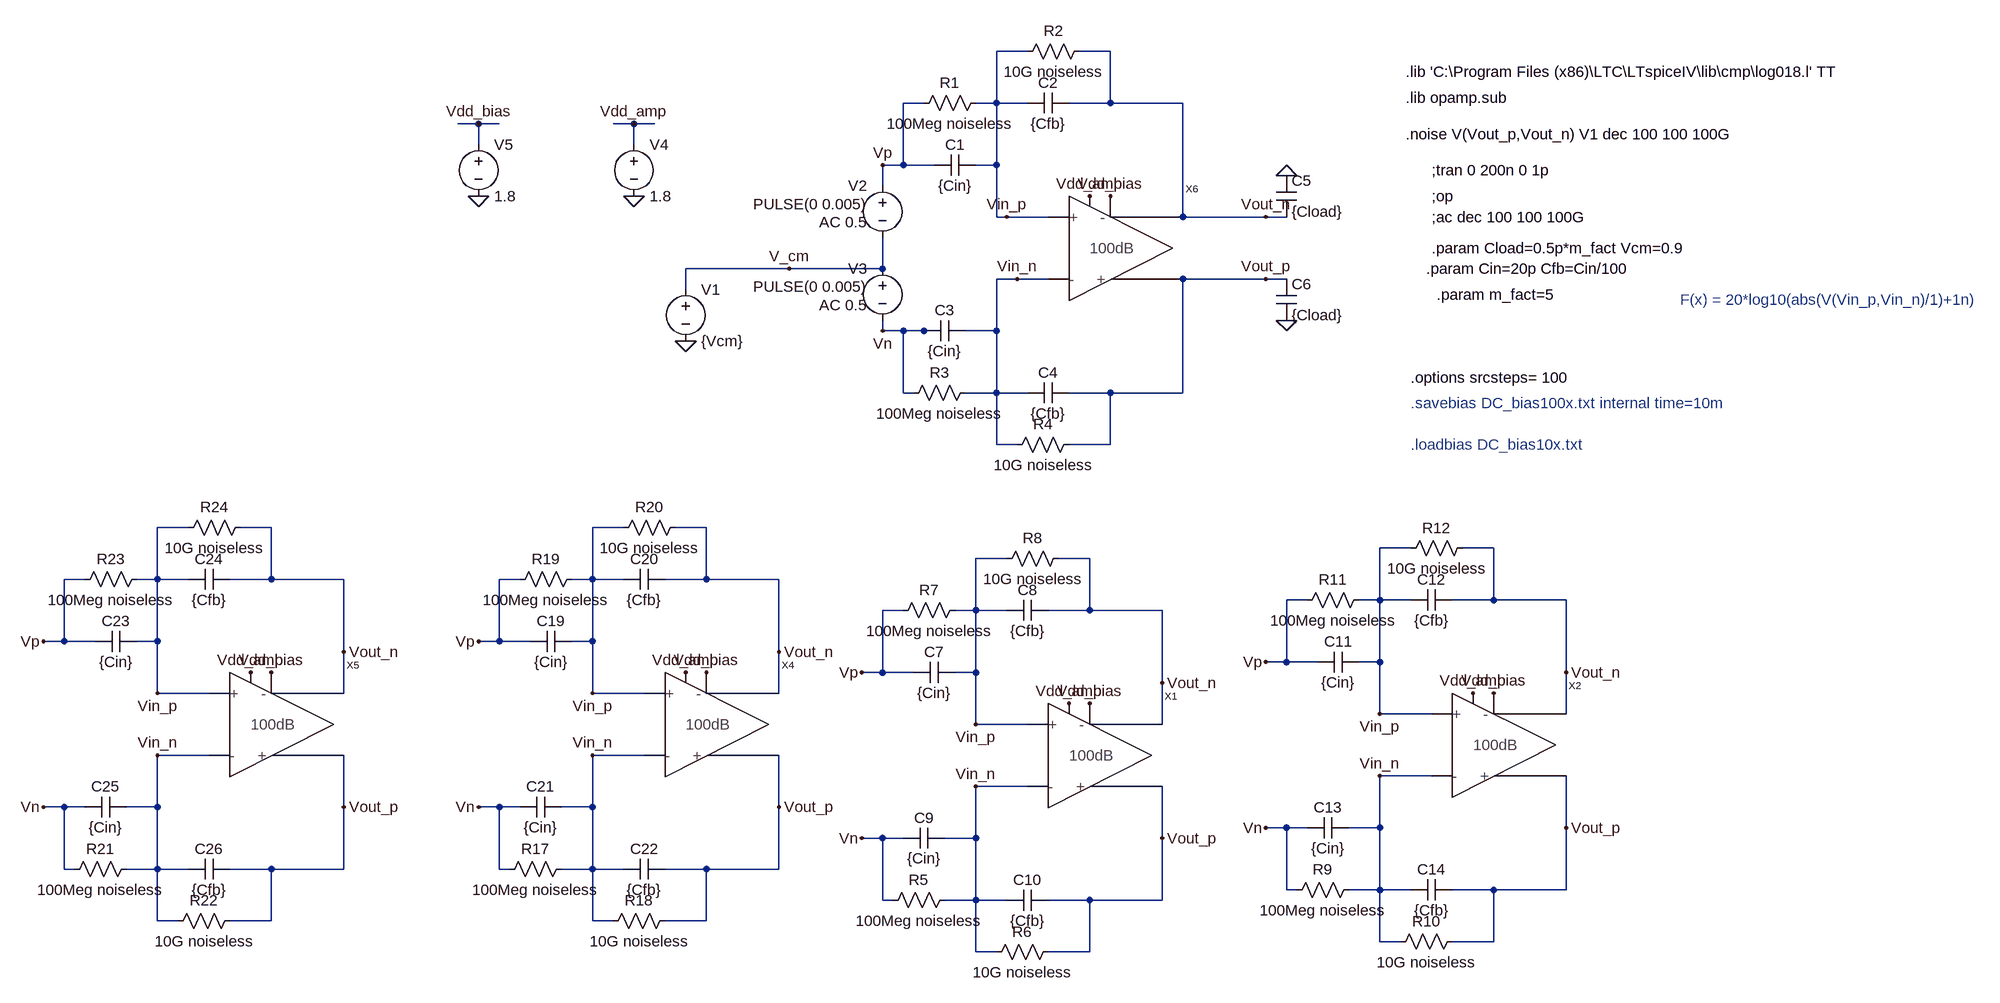
[diagram p0: schematic Discrete_amplifier_10x.asc]
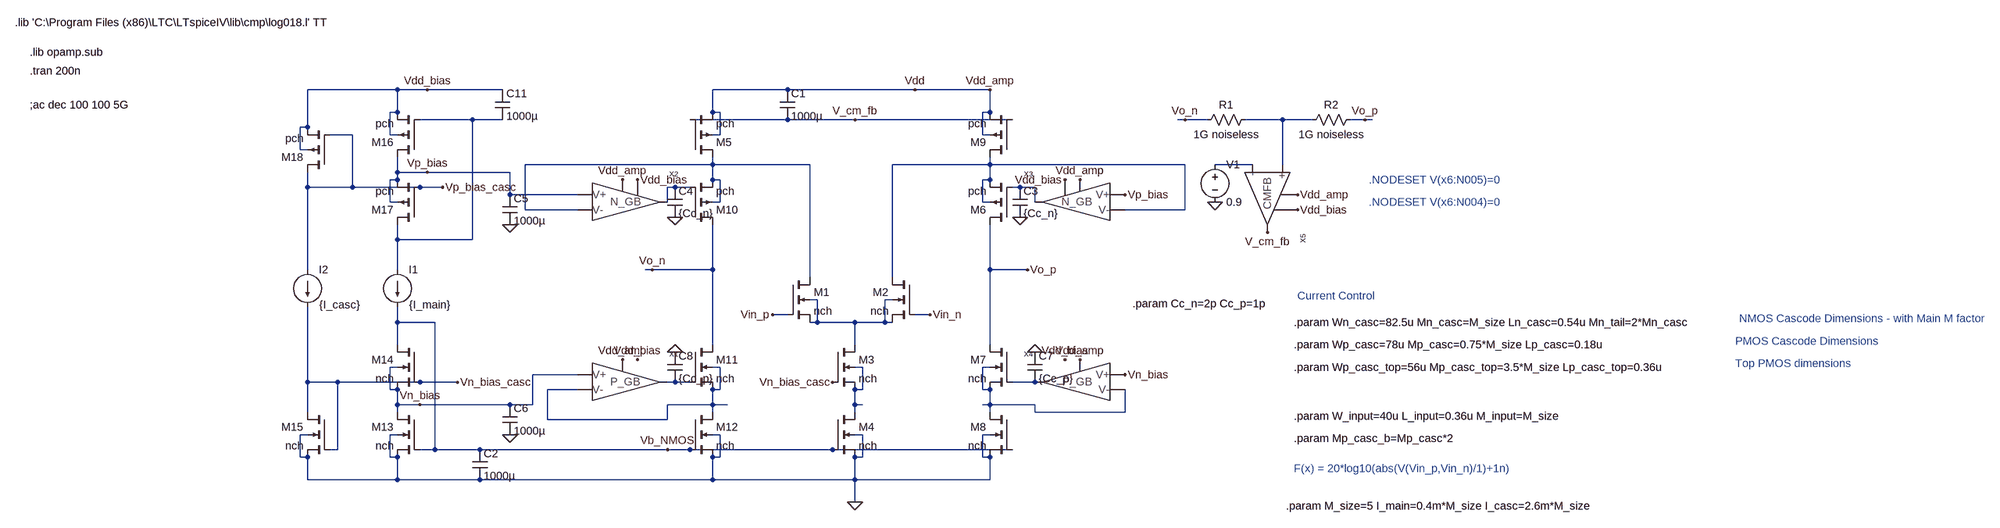
[diagram p1: sub-circuit amplifier_10x_comp_model.asc]
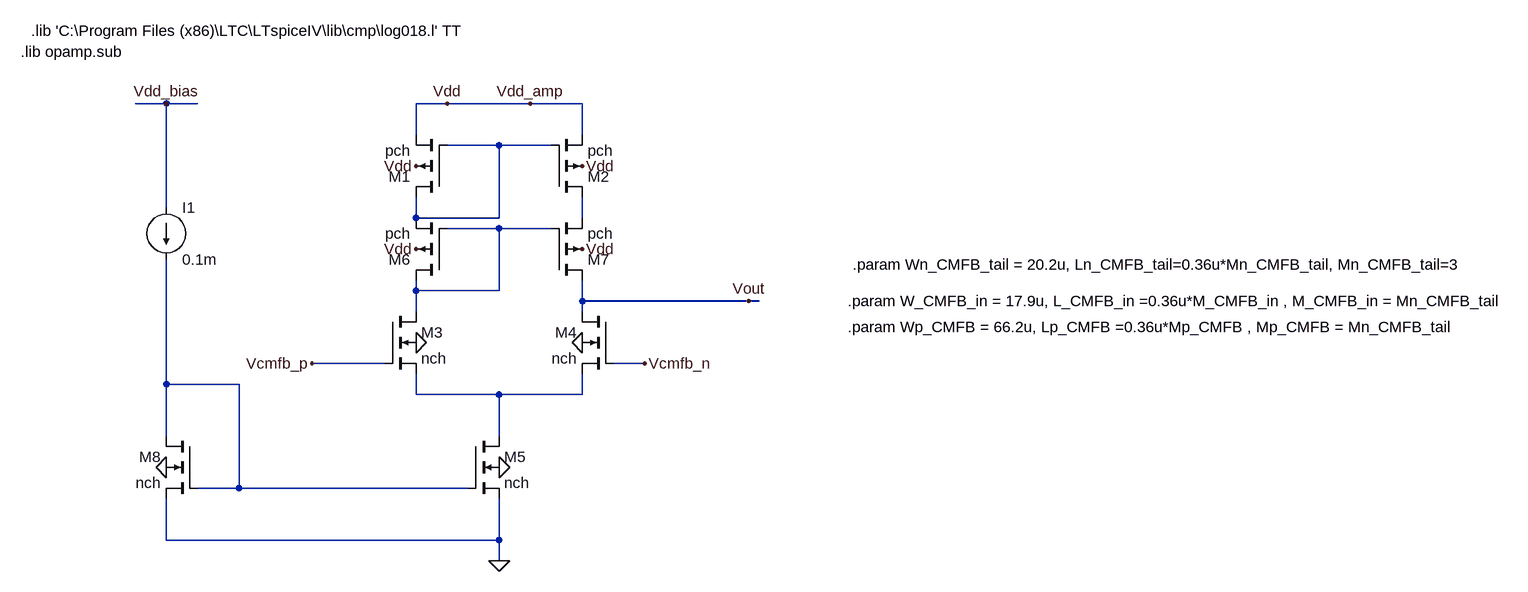
[diagram p2: sub-circuit cmfb_amplifier_comp_model.asc]
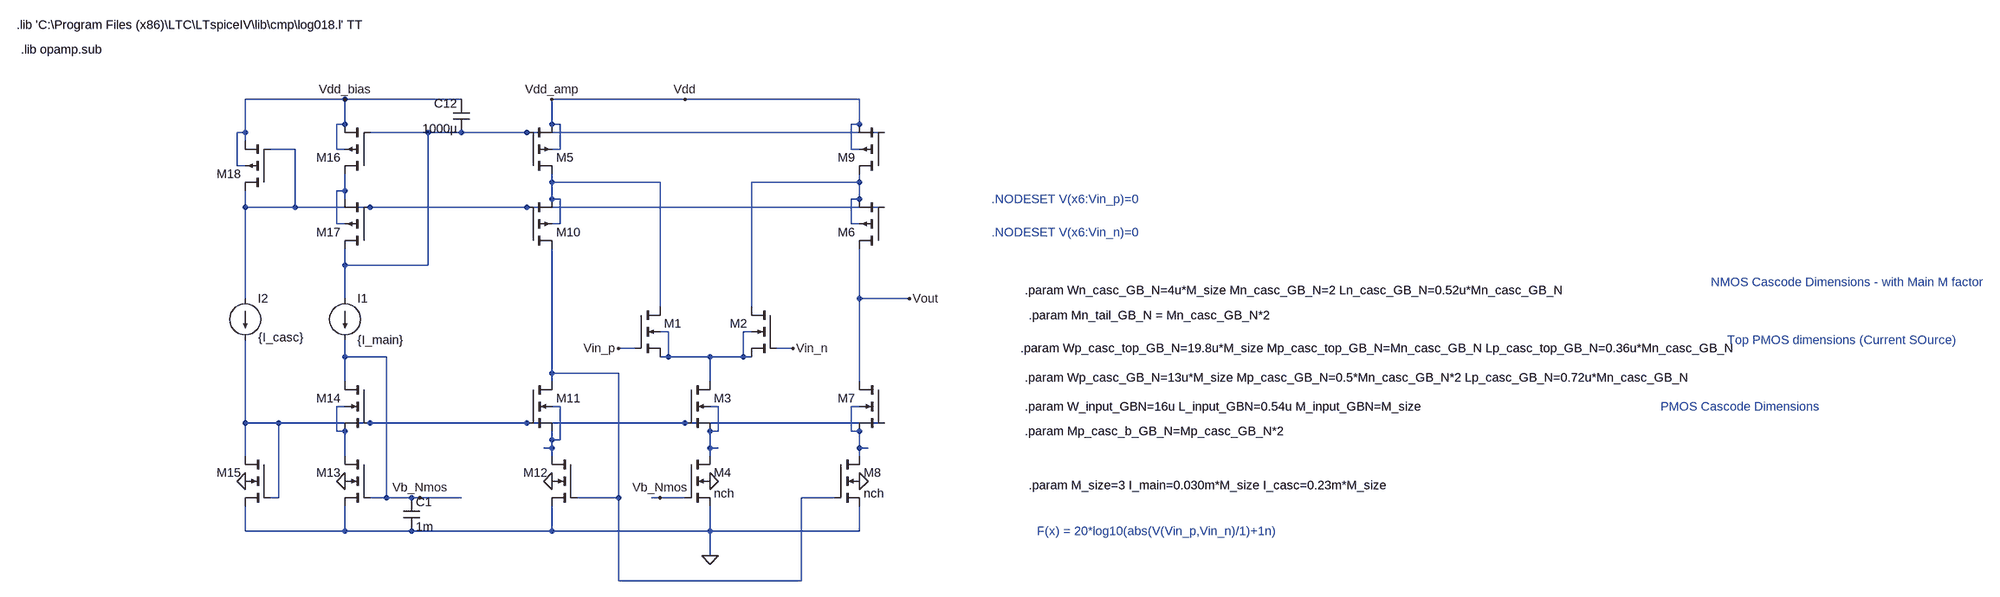
[diagram p3: sub-circuit gb-nmos.asc]
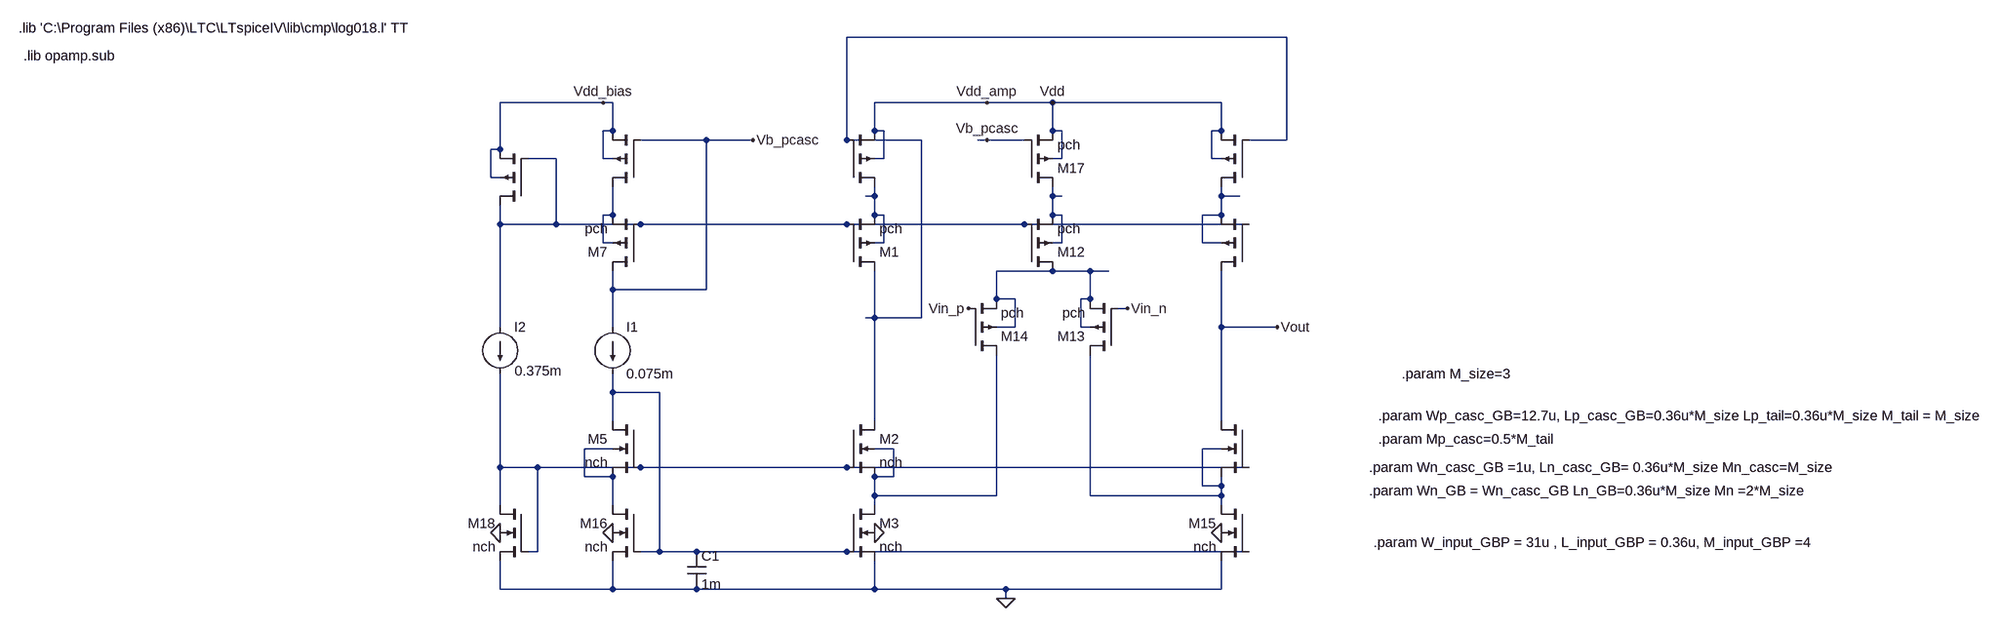
[diagram p4: sub-circuit gb-pmos.asc]
Discrete_amplifier_10x.asc, the LTspice schematic file:
Version 4
SHEET 1 1004 864
WIRE -592 -608 -640 -608
WIRE -464 -608 -512 -608
WIRE -752 -528 -784 -528
WIRE -640 -528 -640 -608
WIRE -640 -528 -672 -528
WIRE -592 -528 -640 -528
WIRE -464 -528 -464 -608
WIRE -464 -528 -528 -528
WIRE -352 -528 -464 -528
WIRE -1440 -496 -1472 -496
WIRE -1408 -496 -1440 -496
WIRE -1200 -496 -1232 -496
WIRE -1168 -496 -1200 -496
WIRE -1440 -464 -1440 -496
WIRE -1200 -464 -1200 -496
WIRE -784 -432 -784 -528
WIRE -784 -432 -816 -432
WIRE -736 -432 -784 -432
WIRE -640 -432 -640 -528
WIRE -640 -432 -672 -432
WIRE -816 -400 -816 -432
WIRE -640 -352 -640 -432
WIRE -624 -352 -640 -352
WIRE -560 -352 -624 -352
WIRE -352 -352 -352 -528
WIRE -224 -352 -352 -352
WIRE -192 -352 -224 -352
WIRE -960 -272 -1120 -272
WIRE -816 -272 -816 -320
WIRE -816 -272 -960 -272
WIRE -608 -256 -640 -256
WIRE -560 -256 -608 -256
WIRE -224 -256 -352 -256
WIRE -192 -256 -224 -256
WIRE -1120 -240 -1120 -272
WIRE -816 -176 -816 -192
WIRE -784 -176 -816 -176
WIRE -752 -176 -784 -176
WIRE -736 -176 -752 -176
WIRE -640 -176 -640 -256
WIRE -640 -176 -688 -176
WIRE -784 -80 -784 -176
WIRE -768 -80 -784 -80
WIRE -640 -80 -640 -176
WIRE -640 -80 -688 -80
WIRE -592 -80 -640 -80
WIRE -464 -80 -528 -80
WIRE -352 -80 -352 -256
WIRE -352 -80 -464 -80
WIRE -640 0 -640 -80
WIRE -608 0 -640 0
WIRE -464 0 -464 -80
WIRE -464 0 -528 0
WIRE -1888 128 -1936 128
WIRE -1760 128 -1808 128
WIRE -1216 128 -1264 128
WIRE -1088 128 -1136 128
WIRE 0 160 -48 160
WIRE 128 160 80 160
WIRE -624 176 -672 176
WIRE -496 176 -544 176
WIRE -2048 208 -2080 208
WIRE -1936 208 -1936 128
WIRE -1936 208 -1968 208
WIRE -1888 208 -1936 208
WIRE -1760 208 -1760 128
WIRE -1760 208 -1824 208
WIRE -1648 208 -1760 208
WIRE -1376 208 -1408 208
WIRE -1264 208 -1264 128
WIRE -1264 208 -1296 208
WIRE -1216 208 -1264 208
WIRE -1088 208 -1088 128
WIRE -1088 208 -1152 208
WIRE -976 208 -1088 208
WIRE -160 240 -192 240
WIRE -48 240 -48 160
WIRE -48 240 -80 240
WIRE 0 240 -48 240
WIRE 128 240 128 160
WIRE 128 240 64 240
WIRE 240 240 128 240
WIRE -784 256 -816 256
WIRE -672 256 -672 176
WIRE -672 256 -704 256
WIRE -624 256 -672 256
WIRE -496 256 -496 176
WIRE -496 256 -560 256
WIRE -384 256 -496 256
WIRE -2080 304 -2080 208
WIRE -2080 304 -2112 304
WIRE -2032 304 -2080 304
WIRE -1936 304 -1936 208
WIRE -1936 304 -1968 304
WIRE -1408 304 -1408 208
WIRE -1408 304 -1440 304
WIRE -1360 304 -1408 304
WIRE -1264 304 -1264 208
WIRE -1264 304 -1296 304
WIRE -1648 320 -1648 208
WIRE -976 320 -976 208
WIRE -192 336 -192 240
WIRE -192 336 -224 336
WIRE -144 336 -192 336
WIRE -48 336 -48 240
WIRE -48 336 -80 336
WIRE -816 352 -816 256
WIRE -816 352 -848 352
WIRE -768 352 -816 352
WIRE -672 352 -672 256
WIRE -672 352 -704 352
WIRE 240 352 240 240
WIRE -384 368 -384 256
WIRE -1936 384 -1936 304
WIRE -1856 384 -1936 384
WIRE -1648 384 -1648 320
WIRE -1264 384 -1264 304
WIRE -1184 384 -1264 384
WIRE -976 384 -976 320
WIRE -48 416 -48 336
WIRE 32 416 -48 416
WIRE 240 416 240 352
WIRE -672 432 -672 352
WIRE -592 432 -672 432
WIRE -384 432 -384 368
WIRE -1856 480 -1936 480
WIRE -1184 480 -1264 480
WIRE 32 512 -48 512
WIRE -592 528 -672 528
WIRE -2080 560 -2112 560
WIRE -2048 560 -2080 560
WIRE -1936 560 -1936 480
WIRE -1936 560 -1984 560
WIRE -1648 560 -1648 480
WIRE -1408 560 -1440 560
WIRE -1376 560 -1408 560
WIRE -1264 560 -1264 480
WIRE -1264 560 -1312 560
WIRE -976 560 -976 480
WIRE -192 592 -224 592
WIRE -160 592 -192 592
WIRE -48 592 -48 512
WIRE -48 592 -96 592
WIRE 240 592 240 512
WIRE -816 608 -848 608
WIRE -784 608 -816 608
WIRE -672 608 -672 528
WIRE -672 608 -720 608
WIRE -384 608 -384 528
WIRE -2080 656 -2080 560
WIRE -2064 656 -2080 656
WIRE -1936 656 -1936 560
WIRE -1936 656 -1984 656
WIRE -1888 656 -1936 656
WIRE -1760 656 -1824 656
WIRE -1648 656 -1648 560
WIRE -1648 656 -1760 656
WIRE -1408 656 -1408 560
WIRE -1392 656 -1408 656
WIRE -1264 656 -1264 560
WIRE -1264 656 -1312 656
WIRE -1216 656 -1264 656
WIRE -1088 656 -1152 656
WIRE -976 656 -976 560
WIRE -976 656 -1088 656
WIRE -192 688 -192 592
WIRE -176 688 -192 688
WIRE -48 688 -48 592
WIRE -48 688 -96 688
WIRE 0 688 -48 688
WIRE 128 688 64 688
WIRE 240 688 240 592
WIRE 240 688 128 688
WIRE -816 704 -816 608
WIRE -800 704 -816 704
WIRE -672 704 -672 608
WIRE -672 704 -720 704
WIRE -624 704 -672 704
WIRE -496 704 -560 704
WIRE -384 704 -384 608
WIRE -384 704 -496 704
WIRE -1936 736 -1936 656
WIRE -1904 736 -1936 736
WIRE -1760 736 -1760 656
WIRE -1760 736 -1824 736
WIRE -1264 736 -1264 656
WIRE -1232 736 -1264 736
WIRE -1088 736 -1088 656
WIRE -1088 736 -1152 736
WIRE -48 768 -48 688
WIRE -16 768 -48 768
WIRE 128 768 128 688
WIRE 128 768 64 768
WIRE -672 784 -672 704
WIRE -640 784 -672 784
WIRE -496 784 -496 704
WIRE -496 784 -560 784
FLAG -1120 -160 0
FLAG -960 -272 V_cm
FLAG -192 -416 0
FLAG -192 -192 0
FLAG -1200 -384 0
FLAG -1200 -496 Vdd_amp
FLAG -496 -384 Vdd_amp
FLAG -224 -256 Vout_p
FLAG -224 -352 Vout_n
FLAG -1440 -384 0
FLAG -1440 -496 Vdd_bias
FLAG -464 -384 Vdd_bias
FLAG -528 400 Vdd_amp
FLAG -496 400 Vdd_bias
FLAG -384 368 Vout_n
FLAG -384 608 Vout_p
FLAG -624 -352 Vin_p
FLAG -608 -256 Vin_n
FLAG -672 432 Vin_p
FLAG -672 528 Vin_n
FLAG -816 -432 Vp
FLAG -848 352 Vp
FLAG -816 -176 Vn
FLAG -848 608 Vn
FLAG 96 384 Vdd_amp
FLAG 128 384 Vdd_bias
FLAG 240 352 Vout_n
FLAG 240 592 Vout_p
FLAG -48 416 Vin_p
FLAG -48 512 Vin_n
FLAG -224 336 Vp
FLAG -224 592 Vn
FLAG -1120 352 Vdd_amp
FLAG -1088 352 Vdd_bias
FLAG -976 320 Vout_n
FLAG -976 560 Vout_p
FLAG -1264 384 Vin_p
FLAG -1264 480 Vin_n
FLAG -1440 304 Vp
FLAG -1440 560 Vn
FLAG -1792 352 Vdd_amp
FLAG -1760 352 Vdd_bias
FLAG -1648 320 Vout_n
FLAG -1648 560 Vout_p
FLAG -1936 384 Vin_p
FLAG -1936 480 Vin_n
FLAG -2112 304 Vp
FLAG -2112 560 Vn
SYMBOL cap -672 -448 R90
WINDOW 0 0 32 VBottom 2
WINDOW 3 32 32 VTop 2
SYMATTR InstName C1
SYMATTR Value {Cin}
SYMBOL cap -528 -544 R90
WINDOW 0 0 32 VBottom 2
WINDOW 3 32 32 VTop 2
SYMATTR InstName C2
SYMATTR Value {Cfb}
SYMBOL cap -688 -160 M270
WINDOW 0 32 32 VTop 2
WINDOW 3 0 32 VBottom 2
SYMATTR InstName C3
SYMATTR Value {Cin}
SYMBOL cap -528 -64 M270
WINDOW 0 32 32 VTop 2
WINDOW 3 0 32 VBottom 2
SYMATTR InstName C4
SYMATTR Value {Cfb}
SYMBOL voltage -1120 -256 R0
WINDOW 123 0 0 Left 2
WINDOW 39 0 0 Left 2
SYMATTR InstName V1
SYMATTR Value {Vcm}
SYMBOL voltage -816 -416 M0
WINDOW 3 24 44 Left 2
WINDOW 123 24 72 Left 2
WINDOW 39 0 0 Left 2
SYMATTR Value PULSE(0 0.005)
SYMATTR Value2 AC 0.5
SYMATTR InstName V2
SYMBOL voltage -816 -288 M0
WINDOW 3 24 44 Left 2
WINDOW 123 24 72 Left 2
WINDOW 39 0 0 Left 2
SYMATTR Value PULSE(0 0.005)
SYMATTR Value2 AC 0.5
SYMATTR InstName V3
SYMBOL res -672 -96 R90
WINDOW 0 0 56 VBottom 2
WINDOW 3 32 56 VTop 2
SYMATTR InstName R3
SYMATTR Value 100Meg noiseless
SYMBOL res -512 -16 R90
WINDOW 0 0 56 VBottom 2
WINDOW 3 32 56 VTop 2
SYMATTR InstName R4
SYMATTR Value 10G noiseless
SYMBOL cap -208 -416 R0
SYMATTR InstName C5
SYMATTR Value {Cload}
SYMBOL cap -208 -192 M180
WINDOW 0 24 56 Left 2
WINDOW 3 24 8 Left 2
SYMATTR InstName C6
SYMATTR Value {Cload}
SYMBOL voltage -1200 -480 R0
WINDOW 123 0 0 Left 2
WINDOW 39 0 0 Left 2
SYMATTR InstName V4
SYMATTR Value 1.8
SYMBOL Amplifier_10x_comp_model -496 -304 R0
SYMATTR InstName X6
SYMBOL voltage -1440 -480 R0
WINDOW 123 0 0 Left 2
WINDOW 39 0 0 Left 2
SYMATTR InstName V5
SYMATTR Value 1.8
SYMBOL res -656 -544 R90
WINDOW 0 0 56 VBottom 2
WINDOW 3 32 56 VTop 2
SYMATTR InstName R1
SYMATTR Value 100Meg noiseless
SYMBOL res -496 -624 R90
WINDOW 0 0 56 VBottom 2
WINDOW 3 32 56 VTop 2
SYMATTR InstName R2
SYMATTR Value 10G noiseless
SYMBOL cap -704 336 R90
WINDOW 0 0 32 VBottom 2
WINDOW 3 32 32 VTop 2
SYMATTR InstName C7
SYMATTR Value {Cin}
SYMBOL cap -560 240 R90
WINDOW 0 0 32 VBottom 2
WINDOW 3 32 32 VTop 2
SYMATTR InstName C8
SYMATTR Value {Cfb}
SYMBOL cap -720 624 M270
WINDOW 0 32 32 VTop 2
WINDOW 3 0 32 VBottom 2
SYMATTR InstName C9
SYMATTR Value {Cin}
SYMBOL cap -560 720 M270
WINDOW 0 32 32 VTop 2
WINDOW 3 0 32 VBottom 2
SYMATTR InstName C10
SYMATTR Value {Cfb}
SYMBOL res -704 688 R90
WINDOW 0 0 56 VBottom 2
WINDOW 3 32 56 VTop 2
SYMATTR InstName R5
SYMATTR Value 100Meg noiseless
SYMBOL res -544 768 R90
WINDOW 0 0 56 VBottom 2
WINDOW 3 32 56 VTop 2
SYMATTR InstName R6
SYMATTR Value 10G noiseless
SYMBOL Amplifier_10x_comp_model -528 480 R0
SYMATTR InstName X1
SYMBOL res -688 240 R90
WINDOW 0 0 56 VBottom 2
WINDOW 3 32 56 VTop 2
SYMATTR InstName R7
SYMATTR Value 100Meg noiseless
SYMBOL res -528 160 R90
WINDOW 0 0 56 VBottom 2
WINDOW 3 32 56 VTop 2
SYMATTR InstName R8
SYMATTR Value 10G noiseless
SYMBOL cap -80 320 R90
WINDOW 0 0 32 VBottom 2
WINDOW 3 32 32 VTop 2
SYMATTR InstName C11
SYMATTR Value {Cin}
SYMBOL cap 64 224 R90
WINDOW 0 0 32 VBottom 2
WINDOW 3 32 32 VTop 2
SYMATTR InstName C12
SYMATTR Value {Cfb}
SYMBOL cap -96 608 M270
WINDOW 0 32 32 VTop 2
WINDOW 3 0 32 VBottom 2
SYMATTR InstName C13
SYMATTR Value {Cin}
SYMBOL cap 64 704 M270
WINDOW 0 32 32 VTop 2
WINDOW 3 0 32 VBottom 2
SYMATTR InstName C14
SYMATTR Value {Cfb}
SYMBOL res -80 672 R90
WINDOW 0 0 56 VBottom 2
WINDOW 3 32 56 VTop 2
SYMATTR InstName R9
SYMATTR Value 100Meg noiseless
SYMBOL res 80 752 R90
WINDOW 0 0 56 VBottom 2
WINDOW 3 32 56 VTop 2
SYMATTR InstName R10
SYMATTR Value 10G noiseless
SYMBOL Amplifier_10x_comp_model 96 464 R0
SYMATTR InstName X2
SYMBOL res -64 224 R90
WINDOW 0 0 56 VBottom 2
WINDOW 3 32 56 VTop 2
SYMATTR InstName R11
SYMATTR Value 100Meg noiseless
SYMBOL res 96 144 R90
WINDOW 0 0 56 VBottom 2
WINDOW 3 32 56 VTop 2
SYMATTR InstName R12
SYMATTR Value 10G noiseless
SYMBOL cap -1296 288 R90
WINDOW 0 0 32 VBottom 2
WINDOW 3 32 32 VTop 2
SYMATTR InstName C19
SYMATTR Value {Cin}
SYMBOL cap -1152 192 R90
WINDOW 0 0 32 VBottom 2
WINDOW 3 32 32 VTop 2
SYMATTR InstName C20
SYMATTR Value {Cfb}
SYMBOL cap -1312 576 M270
WINDOW 0 32 32 VTop 2
WINDOW 3 0 32 VBottom 2
SYMATTR InstName C21
SYMATTR Value {Cin}
SYMBOL cap -1152 672 M270
WINDOW 0 32 32 VTop 2
WINDOW 3 0 32 VBottom 2
SYMATTR InstName C22
SYMATTR Value {Cfb}
SYMBOL res -1296 640 R90
WINDOW 0 0 56 VBottom 2
WINDOW 3 32 56 VTop 2
SYMATTR InstName R17
SYMATTR Value 100Meg noiseless
SYMBOL res -1136 720 R90
WINDOW 0 0 56 VBottom 2
WINDOW 3 32 56 VTop 2
SYMATTR InstName R18
SYMATTR Value 10G noiseless
SYMBOL Amplifier_10x_comp_model -1120 432 R0
SYMATTR InstName X4
SYMBOL res -1280 192 R90
WINDOW 0 0 56 VBottom 2
WINDOW 3 32 56 VTop 2
SYMATTR InstName R19
SYMATTR Value 100Meg noiseless
SYMBOL res -1120 112 R90
WINDOW 0 0 56 VBottom 2
WINDOW 3 32 56 VTop 2
SYMATTR InstName R20
SYMATTR Value 10G noiseless
SYMBOL cap -1968 288 R90
WINDOW 0 0 32 VBottom 2
WINDOW 3 32 32 VTop 2
SYMATTR InstName C23
SYMATTR Value {Cin}
SYMBOL cap -1824 192 R90
WINDOW 0 0 32 VBottom 2
WINDOW 3 32 32 VTop 2
SYMATTR InstName C24
SYMATTR Value {Cfb}
SYMBOL cap -1984 576 M270
WINDOW 0 32 32 VTop 2
WINDOW 3 0 32 VBottom 2
SYMATTR InstName C25
SYMATTR Value {Cin}
SYMBOL cap -1824 672 M270
WINDOW 0 32 32 VTop 2
WINDOW 3 0 32 VBottom 2
SYMATTR InstName C26
SYMATTR Value {Cfb}
SYMBOL res -1968 640 R90
WINDOW 0 0 56 VBottom 2
WINDOW 3 32 56 VTop 2
SYMATTR InstName R21
SYMATTR Value 100Meg noiseless
SYMBOL res -1808 720 R90
WINDOW 0 0 56 VBottom 2
WINDOW 3 32 56 VTop 2
SYMATTR InstName R22
SYMATTR Value 10G noiseless
SYMBOL Amplifier_10x_comp_model -1792 432 R0
SYMATTR InstName X5
SYMBOL res -1952 192 R90
WINDOW 0 0 56 VBottom 2
WINDOW 3 32 56 VTop 2
SYMATTR InstName R23
SYMATTR Value 100Meg noiseless
SYMBOL res -1792 112 R90
WINDOW 0 0 56 VBottom 2
WINDOW 3 32 56 VTop 2
SYMATTR InstName R24
SYMATTR Value 10G noiseless
TEXT -8 -480 Left 2 !.noise V(Vout_p,Vout_n) V1 dec 100 100 100G
TEXT 32 -424 Left 2 !;tran 0 200n 0 1p
TEXT -8 -536 Left 2 !.lib opamp.sub
TEXT 32 -384 Left 2 !;op
TEXT 32 -352 Left 2 !;ac dec 100 100 100G
TEXT -8 -576 Left 2 !.lib 'C:\\Program Files (x86)\\LTC\\LTspiceIV\\lib\\cmp\\log018.l' TT
TEXT 32 -304 Left 2 !.param Cload=0.5p*m_fact Vcm=0.9
TEXT 416 -224 Left 2 ;F(x) = 20*log10(abs(V(Vin_p,Vin_n)/1)+1n)
TEXT 40 -232 Left 2 !.param m_fact=5
TEXT 0 -64 Left 2 ;.savebias DC_bias100x.txt internal time=10m
TEXT 0 0 Left 2 ;.loadbias DC_bias10x.txt
TEXT 0 -104 Left 2 !.options srcsteps= 100
TEXT 24 -272 Left 2 !.param Cin=20p Cfb=Cin/100

The netlist it stands for:
* Discrete_amplifier_10x.asc
C1 Vin_p Vp {Cin}
C2 Vout_n Vin_p {Cfb}
C3 Vin_n Vn {Cin}
C4 Vout_p Vin_n {Cfb}
V1 V_cm 0 {Vcm}
V2 Vp V_cm PULSE(0 0.005) AC 0.5
V3 V_cm Vn PULSE(0 0.005) AC 0.5
R3 Vin_n Vn 100Meg noiseless
R4 Vout_p Vin_n 10G noiseless
C5 0 Vout_n {Cload}
C6 0 Vout_p {Cload}
V4 Vdd_amp 0 1.8
XX6 Vin_p Vin_n Vdd_amp Vout_p Vout_n Vdd_bias amplifier_10x_comp_model
V5 Vdd_bias 0 1.8
R1 Vin_p Vp 100Meg noiseless
R2 Vout_n Vin_p 10G noiseless
C7 Vin_p Vp {Cin}
C8 Vout_n Vin_p {Cfb}
C9 Vin_n Vn {Cin}
C10 Vout_p Vin_n {Cfb}
R5 Vin_n Vn 100Meg noiseless
R6 Vout_p Vin_n 10G noiseless
XX1 Vin_p Vin_n Vdd_amp Vout_p Vout_n Vdd_bias amplifier_10x_comp_model
R7 Vin_p Vp 100Meg noiseless
R8 Vout_n Vin_p 10G noiseless
C11 Vin_p Vp {Cin}
C12 Vout_n Vin_p {Cfb}
C13 Vin_n Vn {Cin}
C14 Vout_p Vin_n {Cfb}
R9 Vin_n Vn 100Meg noiseless
R10 Vout_p Vin_n 10G noiseless
XX2 Vin_p Vin_n Vdd_amp Vout_p Vout_n Vdd_bias amplifier_10x_comp_model
R11 Vin_p Vp 100Meg noiseless
R12 Vout_n Vin_p 10G noiseless
C19 Vin_p Vp {Cin}
C20 Vout_n Vin_p {Cfb}
C21 Vin_n Vn {Cin}
C22 Vout_p Vin_n {Cfb}
R17 Vin_n Vn 100Meg noiseless
R18 Vout_p Vin_n 10G noiseless
XX4 Vin_p Vin_n Vdd_amp Vout_p Vout_n Vdd_bias amplifier_10x_comp_model
R19 Vin_p Vp 100Meg noiseless
R20 Vout_n Vin_p 10G noiseless
C23 Vin_p Vp {Cin}
C24 Vout_n Vin_p {Cfb}
C25 Vin_n Vn {Cin}
C26 Vout_p Vin_n {Cfb}
R21 Vin_n Vn 100Meg noiseless
R22 Vout_p Vin_n 10G noiseless
XX5 Vin_p Vin_n Vdd_amp Vout_p Vout_n Vdd_bias amplifier_10x_comp_model
R23 Vin_p Vp 100Meg noiseless
R24 Vout_n Vin_p 10G noiseless

* block symbol definitions
.subckt amplifier_10x_comp_model Vin_p Vin_n Vdd_amp Vo_p Vo_n Vdd_bias
M1 N003 Vin_p N008 N008 nch l={L_input} w={W_input} m={M_input}
M3 N008 Vn_bias_casc N010 N010 nch l={Ln_casc} w={Wn_casc} m={Mn_tail}
M4 N010 Vb_NMOS 0 0 nch l={Ln_casc} w={Wn_casc} m={Mn_tail}
M10 Vo_n N006 N003 N003 pch l={Lp_casc} w={Wp_casc} m={Mp_casc}
M11 Vo_n N012 N009 N009 nch l={Ln_casc} w={Wn_casc} m={Mn_casc}
M12 N009 Vb_NMOS 0 0 nch l={Ln_casc} w={Wn_casc} m={Mn_casc}
M5 N003 V_cm_fb Vdd_amp Vdd_amp pch l={Lp_casc_top} w={Wp_casc_top} m={Mp_casc_top}
R1 N002 Vo_n 1G noiseless
R2 Vo_p N002 1G noiseless
M13 Vn_bias Vb_NMOS 0 0 nch l={Ln_casc} w={Wn_casc} m={Mn_tail}
M14 Vb_NMOS Vn_bias_casc Vn_bias Vn_bias nch l={Ln_casc} w={Wn_casc} m={Mn_tail}
I2 Vp_bias_casc Vn_bias_casc {I_casc}
M15 Vn_bias_casc Vn_bias_casc 0 0 nch l={Ln_casc} w={Wn_casc} m={Mn_tail}
M16 Vp_bias N001 Vdd_bias Vdd_bias pch l={Lp_casc_top} w={Wp_casc_top} m={Mp_casc_top}
M17 N001 Vp_bias_casc Vp_bias Vp_bias pch l={Lp_casc} w={Wp_casc} m={Mp_casc}
M2 N004 Vin_n N008 N008 nch l={L_input} w={W_input} m={M_input}
M6 Vo_p N007 N004 N004 pch l={Lp_casc} w={Wp_casc} m={Mp_casc}
M7 Vo_p N013 N011 N011 nch l={Ln_casc} w={Wn_Casc} m={Mn_casc}
M8 N011 Vb_NMOS 0 0 nch l={Ln_casc} w={Wn_Casc} m={Mn_casc}
M9 N004 V_cm_fb Vdd_amp Vdd_amp pch l={Lp_casc_top} w={Wp_casc_top} m={Mp_casc_top}
C2 Vb_NMOS 0 1000µ
C11 Vdd_bias N001 1000µ
C1 Vdd_amp V_cm_fb 1000µ
XX5 N002 N005 V_cm_fb Vdd_amp Vdd_bias cmfb_amplifier_comp_model
V1 N005 0 0.9
M18 Vp_bias_casc Vp_bias_casc Vdd_bias Vdd_bias pch l={Lp_casc_top} w={Wp_casc_top} m={Mp_casc_top}
I1 N001 Vb_NMOS {I_main}
XX2 Vp_bias N003 N006 Vdd_amp Vdd_bias gb-nmos
XX3 Vp_bias N004 N007 Vdd_amp Vdd_bias gb-nmos
XX1 Vn_bias N009 N012 Vdd_amp gb-pmos
XX4 Vn_bias N011 N013 Vdd_amp gb-pmos
C3 N007 0 {Cc_n}
C4 N006 0 {Cc_n}
C5 Vp_bias 0 1000µ
C6 Vn_bias 0 1000µ
C7 0 N013 {Cc_p}
C8 0 N012 {Cc_p}
.lib 'C:\Program Files (x86)\LTC\LTspiceIV\lib\cmp\log018.l' TT
.tran 200n
.lib opamp.sub
;ac dec 100 100 5G
.param Wn_casc=82.5u Mn_casc=M_size Ln_casc=0.54u Mn_tail=2*Mn_casc
.param Wp_casc=78u Mp_casc=0.75*M_size Lp_casc=0.18u
.param Wp_casc_top=56u Mp_casc_top=3.5*M_size Lp_casc_top=0.36u
* F(x) = 20*log10(abs(V(Vin_p,Vin_n)/1)+1n)
* Top PMOS dimensions
* PMOS Cascode Dimensions
* NMOS Cascode Dimensions - with Main M factor
.param Mp_casc_b=Mp_casc*2
.param W_input=40u L_input=0.36u M_input=M_size
* Current Control
* .NODESET V(x6:N005)=0
* .NODESET V(x6:N004)=0
.param M_size=5 I_main=0.4m*M_size I_casc=2.6m*M_size
.param Cc_n=2p Cc_p=1p
.ends amplifier_10x_comp_model

.subckt cmfb_amplifier_comp_model Vcmfb_p Vcmfb_n Vout Vdd_amp Vdd_bias
M1 N001 N001 Vdd_amp Vdd_amp pch l={Lp_CMFB} w={Wp_CMFB} m={Mp_CMFB}
M2 N002 N001 Vdd_amp Vdd_amp pch l={Lp_CMFB} w={Wp_CMFB} m={Mp_CMFB}
M3 N003 Vcmfb_p N005 0 nch l={L_CMFB_in} w={W_CMFB_in} m={M_CMFB_in}
M4 Vout Vcmfb_n N005 0 nch l={L_CMFB_in} w={W_CMFB_in} m={M_CMFB_in}
M5 N005 N004 0 0 nch l={Ln_CMFB_tail} w={Wn_CMFB_tail} m={Mn_CMFB_tail}
I1 Vdd_bias N004 0.1m
M8 N004 N004 0 0 nch l={Ln_CMFB_tail} w={Wn_CMFB_tail} m={Mn_CMFB_tail}
M6 N003 N003 N001 Vdd_amp pch l={Lp_CMFB} w={Wp_CMFB} m={Mp_CMFB}
M7 Vout N003 N002 Vdd_amp pch l={Lp_CMFB} w={Wp_CMFB} m={Mp_CMFB}
.lib 'C:\Program Files (x86)\LTC\LTspiceIV\lib\cmp\log018.l' TT
.lib opamp.sub
.param Wn_CMFB_tail = 20.2u, Ln_CMFB_tail=0.36u*Mn_CMFB_tail, Mn_CMFB_tail=3
.param Wp_CMFB = 66.2u, Lp_CMFB =0.36u*Mp_CMFB , Mp_CMFB = Mn_CMFB_tail
.param W_CMFB_in = 17.9u, L_CMFB_in =0.36u*M_CMFB_in , M_CMFB_in = Mn_CMFB_tail
.ends cmfb_amplifier_comp_model

.subckt gb-nmos Vin_p Vin_n Vout Vdd_amp Vdd_bias
M1 N003 Vin_p N006 N006 nch l={L_input_GBN} w={W_input_GBN} m={M_input_GBN}
M3 N006 N012 N010 N010 nch l={Ln_casc_GB_N} w={Wn_casc_GB_N} m={Mn_tail_GB_N}
M4 N010 Vb_Nmos 0 0 nch l={Ln_casc_GB_N} w={Wn_casc_GB_N} m={Mn_tail_GB_N}
M10 N007 N002 N003 N003 pch l={Lp_casc_GB_N} w={Wp_casc_GB_N} m={Mp_casc_GB_N}
M11 N007 N012 N009 N009 nch l={Ln_casc_GB_N} w={Wn_casc_GB_N} m={Mn_casc_GB_N}
M12 N009 N007 0 0 nch l={Ln_casc_GB_N} w={Wn_casc_GB_N} m={Mn_casc_GB_N}
M5 N003 N001 Vdd_amp Vdd_amp pch l={Lp_casc_top_GB_N} w={Wp_casc_top_GB_N} m={Mp_casc_top_GB_N}
M13 N008 Vb_Nmos 0 0 nch l={Ln_casc_GB_N} w={Wn_casc_GB_N} m={Mn_tail_GB_N}
I1 N001 Vb_Nmos {I_main}
M14 Vb_Nmos N012 N008 N008 nch l={Ln_casc_GB_N} w={Wn_casc_GB_N} m={Mn_tail_GB_N}
I2 N002 N012 {I_casc}
M15 N012 N012 0 0 nch l={Ln_casc_GB_N} w={Wn_casc_GB_N} m={Mn_tail_GB_N}
M17 N001 N002 N005 N005 pch l={Lp_casc_GB_N} w={Wp_casc_GB_N} m={Mp_casc_GB_N}
M18 N002 N002 Vdd_bias Vdd_bias pch l={Lp_casc_top_GB_N} w={Wp_casc_GB_N} m={Mp_casc_top_GB_N}
M2 N004 Vin_n N006 N006 nch l={L_input_GBN} w={W_input_GBN} m={M_input_GBN}
M6 Vout N002 N004 N004 pch l={Lp_casc_GB_N} w={Wp_casc_GB_N} m={Mp_casc_GB_N}
M7 Vout N012 N011 N011 nch l={Ln_casc_GB_N} w={Wn_Casc_GB_N} m={Mn_casc_GB_N}
M8 N011 N007 0 0 nch l={Ln_casc_GB_N} w={Wn_Casc_GB_N} m={Mn_casc_GB_N}
M9 N004 N001 Vdd_amp Vdd_amp pch l={Lp_casc_top_GB_N} w={Wp_casc_top_GB_N} m={Mp_casc_top_GB_N}
C12 N001 Vdd_bias 1000µ
C1 Vb_Nmos 0 1m
M16 N005 N001 Vdd_bias Vdd_bias pch l={Lp_casc_top_GB_N} w={Wp_casc_top_GB_N} m={Mp_casc_top_GB_N}
.lib 'C:\Program Files (x86)\LTC\LTspiceIV\lib\cmp\log018.l' TT
.lib opamp.sub
.param Wn_casc_GB_N=4u*M_size Mn_casc_GB_N=2 Ln_casc_GB_N=0.52u*Mn_casc_GB_N
.param Wp_casc_GB_N=13u*M_size Mp_casc_GB_N=0.5*Mn_casc_GB_N*2 Lp_casc_GB_N=0.72u*Mn_casc_GB_N
.param Wp_casc_top_GB_N=19.8u*M_size Mp_casc_top_GB_N=Mn_casc_GB_N Lp_casc_top_GB_N=0.36u*Mn_casc_GB_N
* F(x) = 20*log10(abs(V(Vin_p,Vin_n)/1)+1n)
* Top PMOS dimensions (Current SOurce)
* PMOS Cascode Dimensions
* NMOS Cascode Dimensions - with Main M factor
.param Mp_casc_b_GB_N=Mp_casc_GB_N*2
.param W_input_GBN=16u L_input_GBN=0.54u M_input_GBN=M_size
* .NODESET V(x6:Vin_p)=0
* .NODESET V(x6:Vin_n)=0
.param Mn_tail_GB_N = Mn_casc_GB_N*2
.param M_size=3 I_main=0.030m*M_size I_casc=0.23m*M_size
.ends gb-nmos

.subckt gb-pmos Vin_p Vin_n Vout Vdd
M1 N001 N002 N003 N003 pch l={Lp_casc_GB} w={Wp_casc_GB} m={Mp_casc}
M2 N001 N012 N008 N008 nch l={Ln_casc_GB} w={Wn_casc_GB} m={Mn_casc}
M3 N008 N010 0 0 nch l={Ln_casc_GB} w={Wn_GB} m={Mn}
M4 N003 N001 Vdd Vdd pch l={Lp_casc_GB} w={Wp_casc_GB} m={Mp_casc}
I1 Vb_pcasc N010 0.075m
M5 N010 N012 N011 N011 nch l={Ln_casc_GB} w={Wn_casc_GB} m={Mn_casc}
I2 N002 N012 0.375m
M6 N006 Vb_pcasc Vdd_bias Vdd_bias pch l={Lp_casc_GB} w={Wp_casc_GB} m={M_tail}
M7 Vb_pcasc N002 N006 N006 pch l={Lp_casc_GB} w={Wp_casc_GB} m={M_tail}
M8 N002 N002 Vdd_bias Vdd_bias pch l={Lp_casc_GB} w={Wp_casc_GB} m={M_tail}
M9 Vout N002 N005 N005 pch l={Lp_casc_GB} w={Wp_casc_GB} m={Mp_casc}
M10 Vout N012 N009 N009 nch l={Ln_casc_GB} w={Wn_casc_GB} m={Mn_casc}
M11 N005 N001 Vdd Vdd pch l={Lp_casc_GB} w={Wp_casc_GB} m={Mp_casc}
M12 N007 N002 N004 N004 pch l={Lp_tail} w={Wp_casc_GB} m={M_tail}
M13 N009 Vin_n N007 N007 pch l={L_input_GBP} w={W_input_GBP} m={M_input_GBP}
M14 N008 Vin_p N007 N007 pch l={L_input_GBP} w={W_input_GBP} m={M_input_GBP}
C1 N010 0 1m
M15 N009 N010 0 0 nch l={Ln_casc_GB} w={Wn_GB} m={Mn}
M16 N011 N010 0 0 nch l={Ln_casc_GB} w={Wn_GB} m={Mn}
M17 N004 Vb_pcasc Vdd Vdd pch l={Lp_tail} w={Wp_casc_GB} m={M_tail}
M18 N012 N012 0 0 nch l={Ln_casc_GB} w={Wn_GB} m={Mn}
.lib 'C:\Program Files (x86)\LTC\LTspiceIV\lib\cmp\log018.l' TT
.lib opamp.sub
.param Wp_casc_GB=12.7u, Lp_casc_GB=0.36u*M_size Lp_tail=0.36u*M_size M_tail = M_size
.param Wn_casc_GB =1u, Ln_casc_GB= 0.36u*M_size Mn_casc=M_size
.param Wn_GB = Wn_casc_GB Ln_GB=0.36u*M_size Mn =2*M_size
.param W_input_GBP = 31u , L_input_GBP = 0.36u, M_input_GBP =4
.param M_size=3
.param Mp_casc=0.5*M_tail
.ends gb-pmos

.model NMOS NMOS
.model PMOS PMOS
.lib standard.mos
.noise V(Vout_p,Vout_n) V1 dec 100 100 100G
;tran 0 200n 0 1p
.lib opamp.sub
;op
;ac dec 100 100 100G
.lib 'C:\Program Files (x86)\LTC\LTspiceIV\lib\cmp\log018.l' TT
.param Cload=0.5p*m_fact Vcm=0.9
* F(x) = 20*log10(abs(V(Vin_p,Vin_n)/1)+1n)
.param m_fact=5
* .savebias DC_bias100x.txt internal time=10m
* .loadbias DC_bias10x.txt
.options srcsteps= 100
.param Cin=20p Cfb=Cin/100
.backanno
.end